# EAGLE design uacs-top (EAGLE 7.1.0)

## Sheet 1 of 3: DISPLAY
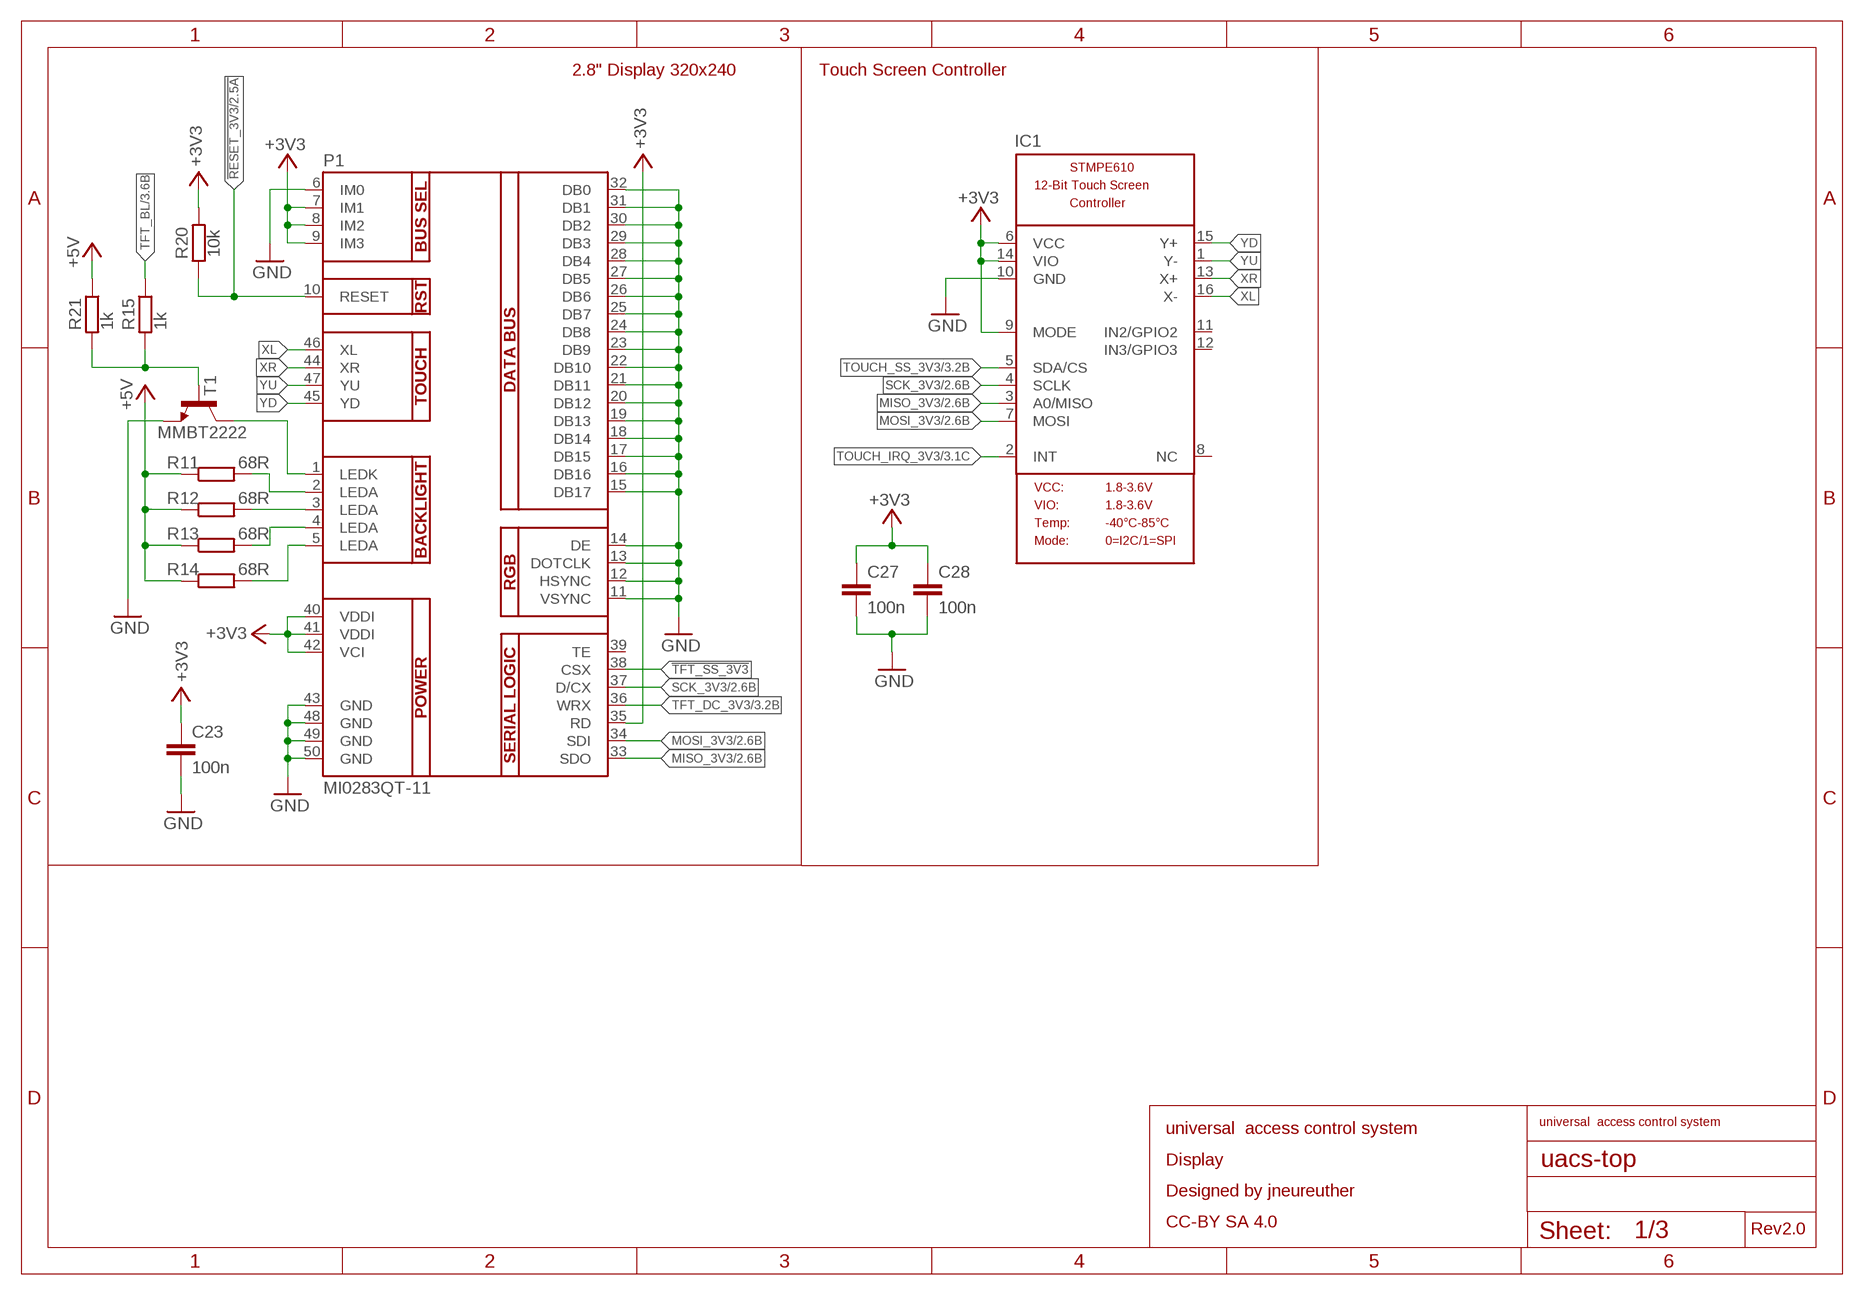
[diagram p0: schematic, sheet 1]

### Parts
C23  100n  C-EUC0603  [C0603]
C27  100n  C-EUC0603  [C0603]
C28  100n  C-EUC0603  [C0603]
IC1  STMPE610  [QFN16_3MM]
P1  MI0283QT-11  [MI0283QT-11]
R11  68R  R-EU_R0603  [R0603]
R12  68R  R-EU_R0603  [R0603]
R13  68R  R-EU_R0603  [R0603]
R14  68R  R-EU_R0603  [R0603]
R15  1k  R-EU_R0603  [R0603]
R20  10k  R-EU_R0603  [R0603]
R21  1k  R-EU_R0603  [R0603]
T1  MMBT2222  MMBT2222ALT1-NPN-SOT23-BEC  [SOT23-BEC]

### Nets
!RESET_3V3: P1.10(RESET) R20.1 ; also sheet 2,3
!TFT_SS_3V3: P1.38(CSX)
+3V3: C23.1 C27.1 C28.1 IC1.6(VCC) IC1.9(MODE) IC1.14(VIO) P1.7(IM1) P1.8(IM2) P1.9(IM3) P1.35(RD) P1.40(VDDI) P1.41(VDDI) P1.42(VCI) R20.2 ; also sheet 2,3
+5V: R11.1 R12.1 R13.1 R14.1 R21.1 ; also sheet 3
GND: C23.2 C27.2 C28.2 IC1.10(GND) P1.6(IM0) P1.11(VSYNC) P1.12(HSYNC) P1.13(DOTCLK) P1.14(DE) P1.15(DB17) P1.16(DB16) P1.17(DB15) P1.18(DB14) P1.19(DB13) P1.20(DB12) P1.21(DB11) P1.22(DB10) P1.23(DB9) P1.24(DB8) P1.25(DB7) P1.26(DB6) P1.27(DB5) P1.28(DB4) P1.29(DB3) P1.30(DB2) P1.31(DB1) P1.32(DB0) P1.43(GND) P1.48(GND) P1.49(GND) P1.50(GND) T1.E ; also sheet 2,3
MISO_3V3: IC1.3(A0/MISO) P1.33(SDO) ; also sheet 2,3
MOSI_3V3: IC1.7(MOSI) P1.34(SDI) ; also sheet 2,3
N$15: P1.5(LEDA) R14.2
N$16: P1.4(LEDA) R13.2
N$17: P1.3(LEDA) R12.2
N$18: P1.2(LEDA) R11.2
N$19: P1.1(LEDK) T1.C
N$21: R15.2 R21.2 T1.B
SCK_3V3: IC1.4(SCLK) P1.37(D/CX) ; also sheet 2,3
TFT_BL: R15.1 ; also sheet 3
TFT_DC_3V3: P1.36(WRX) ; also sheet 3
TOUCH_IRQ_3V3: IC1.2(INT) ; also sheet 3
TOUCH_SS_3V3: IC1.5(SDA/CS) ; also sheet 3
XL: IC1.16(X-) P1.46(XL)
XR: IC1.13(X+) P1.44(XR)
YD: IC1.15(Y+) P1.45(YD)
YU: IC1.1(Y-) P1.47(YU)
Unconnected: IC1.8(NC) IC1.11(IN2/GPIO2) IC1.12(IN3/GPIO3) P1.39(TE)

### Notes on the sheet
- 2.8" Display 320x240 | Touch Screen Controller
- universal  access control system
- universal  access control system
  Display
  Designed by jneureuther
  CC-BY SA 4.0
- Rev2.0

## Sheet 2 of 3: RFID
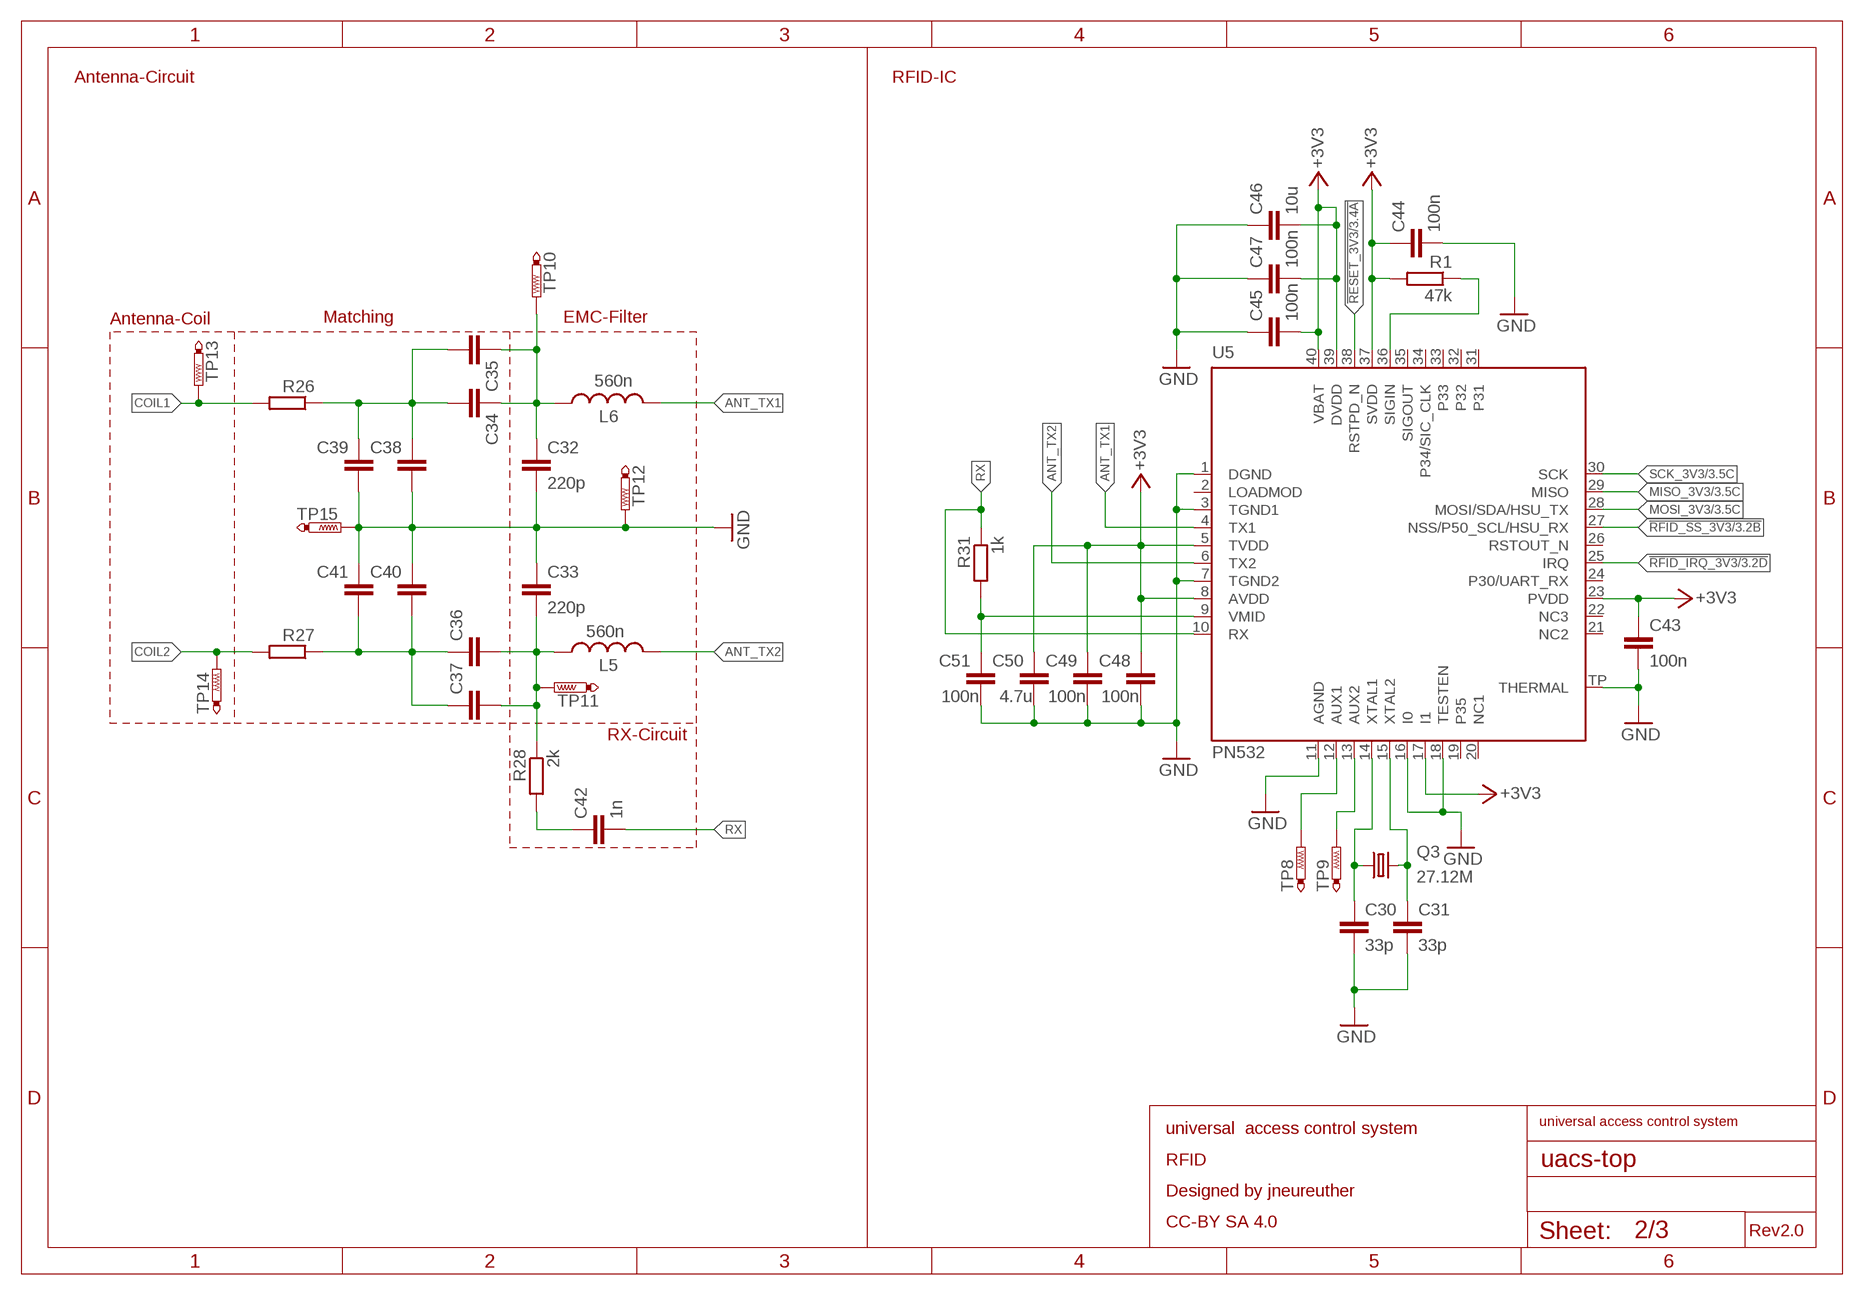
[diagram p1: schematic, sheet 2]

### Parts
C30  33p  C-EUC0603  [C0603]
C31  33p  C-EUC0603  [C0603]
C32  220p  C-EUC0603  [C0603]
C33  220p  C-EUC0603  [C0603]
C34  C-EUC0603  [C0603]
C35  C-EUC0603  [C0603]
C36  C-EUC0603  [C0603]
C37  C-EUC0603  [C0603]
C38  C-EUC0603  [C0603]
C39  C-EUC0603  [C0603]
C40  C-EUC0603  [C0603]
C41  C-EUC0603  [C0603]
C42  1n  C-EUC0603  [C0603]
C43  100n  C-EUC0603  [C0603]
C44  100n  C-EUC0603  [C0603]
C45  100n  C-EUC0603  [C0603]
C46  10u  C-EUC0603  [C0603]
C47  100n  C-EUC0603  [C0603]
C48  100n  C-EUC0603  [C0603]
C49  100n  C-EUC0603  [C0603]
C50  4.7u  C-EUC0603  [C0603]
C51  100n  C-EUC0603  [C0603]
L5  560n  INDUCTOR0805  [0805]
L6  560n  INDUCTOR0805  [0805]
Q3  27.12M  CRYSTALCTS406  [CTS406]
R1  47k  R-EU_R0603  [R0603]
R26  R-EU_R0603  [R0603]
R27  R-EU_R0603  [R0603]
R28  2k  R-EU_R0603  [R0603]
R31  1k  R-EU_R0603  [R0603]
TP8  PTR1TP20R  [TP20R]
TP9  PTR1TP20R  [TP20R]
TP10  PTR1TP20R  [TP20R]
TP11  PTR1TP20R  [TP20R]
TP12  PTR1TP20R  [TP20R]
TP13  PTR1TP20R  [TP20R]
TP14  PTR1TP20R  [TP20R]
TP15  PTR1TP20R  [TP20R]
U5  PN532  [HVQFN40-6X6]

### Nets
!RESET_3V3: U5.38(RSTPD_N) ; also sheet 1,3
!RFID_IRQ_3V3: U5.25(IRQ) ; also sheet 3
!RFID_SS_3V3: U5.27(NSS/P50_SCL/HSU_RX) ; also sheet 3
+3V3: C43.1 C44.1 C45.2 C46.2 C47.2 C48.1 C49.1 C50.1 R1.2 U5.5(TVDD) U5.8(AVDD) U5.17(I1) U5.23(PVDD) U5.37(SVDD) U5.39(DVDD) U5.40(VBAT) ; also sheet 1,3
ANT_TX1: L6.1 U5.4(TX1)
ANT_TX2: L5.1 U5.6(TX2)
COIL1: R26.2 TP13.TP
COIL2: R27.2 TP14.TP
GND: C30.2 C31.2 C32.2 C33.1 C38.2 C39.2 C40.1 C41.1 C43.2 C44.2 C45.1 C46.1 C47.1 C48.2 C49.2 C50.2 C51.2 TP12.TP TP15.TP U5.1(DGND) U5.3(TGND1) U5.7(TGND2) U5.11(AGND) U5.16(I0) U5.18(TESTEN) U5.TP(THERMAL) ; also sheet 1,3
MISO_3V3: U5.29(MISO) ; also sheet 1,3
MOSI_3V3: U5.28(MOSI/SDA/HSU_TX) ; also sheet 1,3
N$1: R1.1 U5.36(SIGIN)
N$20: C42.1 R28.2
N$22: TP8.TP U5.12(AUX1)
N$23: TP9.TP U5.13(AUX2)
N$24: C33.2 C36.2 C37.2 L5.2 R28.1 TP11.TP
N$25: C32.1 C34.1 C35.1 L6.2 TP10.TP
N$26: C51.1 R31.2 U5.9(VMID)
N$27: C34.2 C35.2 C38.1 C39.1 R26.1
N$29: C30.1 Q3.1 U5.14(XTAL1)
N$30: C31.1 Q3.3 U5.15(XTAL2)
N$43: C36.1 C37.1 C40.2 C41.2 R27.1
RX: C42.2 R31.1 U5.10(RX)
SCK_3V3: U5.30(SCK) ; also sheet 1,3
Unconnected: U5.2(LOADMOD) U5.19(P35) U5.20(NC1) U5.21(NC2) U5.22(NC3) U5.24(P30/UART_RX) U5.26(RSTOUT_N) U5.31 U5.32 U5.33 U5.34(P34/SIC_CLK) U5.35(SIGOUT)

### Notes on the sheet
- Antenna-Circuit | RFID-IC
- Antenna-Coil | Matching | EMC-Filter
- RX-Circuit
- universal access control system
- universal  access control system
  RFID
  Designed by jneureuther
  CC-BY SA 4.0
- Rev2.0

## Sheet 3 of 3
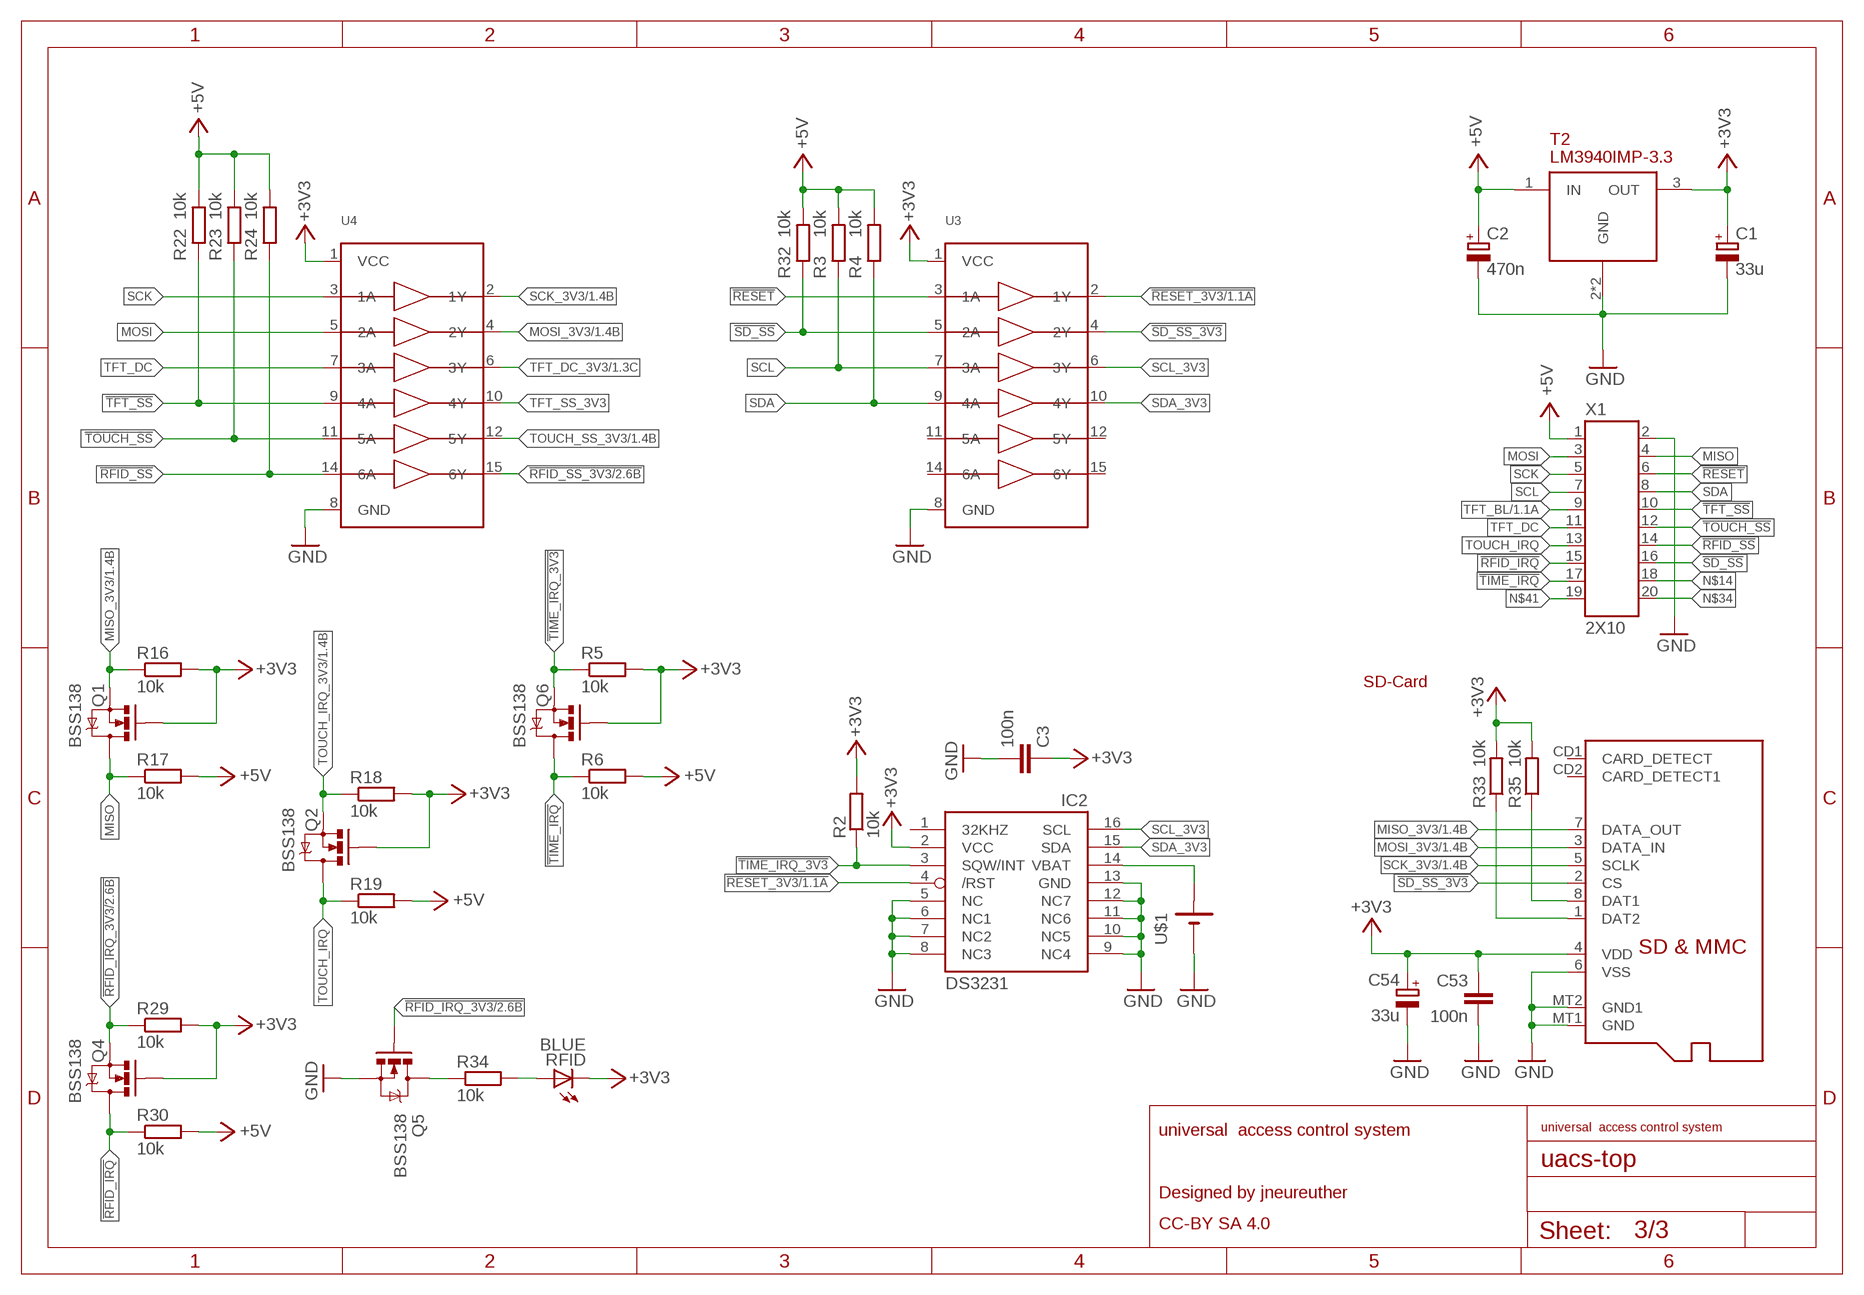
[diagram p2: schematic, sheet 3]

### Parts
C1  33u  CPOL-EUD  [PANASONIC_D]
C2  470n  CPOL-EUB  [PANASONIC_B]
C3  100n  C-EUC0603  [C0603]
C53  100n  C-EUC0603  [C0603]
C54  33u  CPOL-EUC/6032-28R  [C/6032-28R]
IC2  DS3231/SO  [SO16W]
Q1  BSS138  MOSFET-NCHANNELBSS123LT1G  [SOT23]
Q2  BSS138  MOSFET-NCHANNELBSS123LT1G  [SOT23]
Q4  BSS138  MOSFET-NCHANNELBSS123LT1G  [SOT23]
Q5  BSS138  MOSFET-NCHANNELBSS123LT1G  [SOT23]
Q6  BSS138  MOSFET-NCHANNELBSS123LT1G  [SOT23]
R2  10k  R-EU_R0603  [R0603]
R3  10k  R-EU_R0603  [R0603]
R4  10k  R-EU_R0603  [R0603]
R5  10k  R-EU_R0603  [R0603]
R6  10k  R-EU_R0603  [R0603]
R16  10k  R-EU_R0603  [R0603]
R17  10k  R-EU_R0603  [R0603]
R18  10k  R-EU_R0603  [R0603]
R19  10k  R-EU_R0603  [R0603]
R22  10k  R-EU_R0603  [R0603]
R23  10k  R-EU_R0603  [R0603]
R24  10k  R-EU_R0603  [R0603]
R29  10k  R-EU_R0603  [R0603]
R30  10k  R-EU_R0603  [R0603]
R32  10k  R-EU_R0603  [R0603]
R33  10k  R-EU_R0603  [R0603]
R34  10k  R-EU_R0603  [R0603]
R35  10k  R-EU_R0603  [R0603]
RFID  BLUE  LEDCHIP-LED0603  [CHIP-LED0603]
T2  LM3940IMP-3.3  [SOT223]
U3  74HC4050D  [SOIC16]
U4  74HC4050D  [SOIC16]
U$1  CR1220SMT  [CR1220-SMD]
X1  2X10  [2X10]
X3  MICROSD  [MICROSD]

### Nets
!RESET: U3.3(1A) X1.6
!RESET_3V3: IC2.4(/RST) U3.2(1Y) ; also sheet 1,2
!RFID_IRQ: Q4.3(D) R30.1 X1.15
!RFID_IRQ_3V3: Q4.2(S) Q5.1(G) R29.1 ; also sheet 2
!RFID_SS: R24.1 U4.14(6A) X1.14
!RFID_SS_3V3: U4.15(6Y) ; also sheet 2
!SD_SS: R32.1 U3.5(2A) X1.16
!SD_SS_3V3: U3.4(2Y) X3.2(CS)
!TFT_SS: R22.1 U4.9(4A) X1.10
!TIME_IRQ: Q6.3(D) R6.1 X1.17
!TIME_IRQ_3V3: IC2.3(SQW/INT) Q6.2(S) R2.1 R5.1
!TOUCH_SS: R23.1 U4.11(5A) X1.12
+3V3: C1.+ C3.1 C53.1 C54.+ IC2.2(VCC) Q1.1(G) Q2.1(G) Q4.1(G) Q6.1(G) R2.2 R5.2 R16.2 R18.2 R29.2 R33.2 R35.2 RFID.C T2.3(OUT) U3.1(VCC) U4.1(VCC) X3.4(VDD) ; also sheet 1,2
+5V: C2.+ R3.2 R4.2 R6.2 R17.2 R19.2 R22.2 R23.2 R24.2 R30.2 R32.2 T2.1(IN) X1.1 ; also sheet 1
GND: C1.- C2.- C3.2 C53.2 C54.- IC2.5(NC) IC2.6(NC1) IC2.7(NC2) IC2.8(NC3) IC2.9(NC4) IC2.10(NC5) IC2.11(NC6) IC2.12(NC7) IC2.13(GND) Q5.2(S) T2.2(GND) T2.4(GND) U3.8(GND) U4.8(GND) U$1.-(VSS) X1.2 X3.6(VSS) X3.MT1(GND) X3.MT2(GND1) ; also sheet 1,2
MISO: Q1.3(D) R17.1 X1.4
MISO_3V3: Q1.2(S) R16.1 X3.7(DATA_OUT) ; also sheet 1,2
MOSI: U4.5(2A) X1.3
MOSI_3V3: U4.4(2Y) X3.3(DATA_IN) ; also sheet 1,2
N$2: IC2.14(VBAT) U$1.+$1(VCC) U$1.+$2(VCC)
N$14: X1.18
N$28: R35.1 X3.8(DAT1)
N$31: R34.2 RFID.A
N$32: R33.1 X3.1(DAT2)
N$33: Q5.3(D) R34.1
N$34: X1.20
N$41: X1.19
SCK: U4.3(1A) X1.5
SCK_3V3: U4.2(1Y) X3.5(SCLK) ; also sheet 1,2
SCL: R3.1 U3.7(3A) X1.7
SCL_3V3: IC2.16(SCL) U3.6(3Y)
SDA: R4.1 U3.9(4A) X1.8
SDA_3V3: IC2.15(SDA) U3.10(4Y)
TFT_BL: X1.9 ; also sheet 1
TFT_DC: U4.7(3A) X1.11
TFT_DC_3V3: U4.6(3Y) ; also sheet 1
TFT_SS_3V3: U4.10(4Y)
TOUCH_IRQ: Q2.3(D) R19.1 X1.13
TOUCH_IRQ_3V3: Q2.2(S) R18.1 ; also sheet 1
TOUCH_SS_3V3: U4.12(5Y) ; also sheet 1
Unconnected: IC2.1(32KHZ) U3.11(5A) U3.12(5Y) U3.14(6A) U3.15(6Y) X3.CD1(CARD_DETECT) X3.CD2(CARD_DETECT1)

### Notes on the sheet
- SD-Card
- universal  access control system
- universal  access control system
  
  Designed by jneureuther
  CC-BY SA 4.0

## Library data of the parts
C1 C2 C54 = rcl:CPOL-EU: POLARIZED CAPACITOR, European symbol
C3 C23 C27 C28 C30-C51 C53 = rcl:C-EU: CAPACITOR, European symbol
IC1 = microbuilder:STMPE610: STMPE610 - 12-Bit Touch Screen Controller
IC2 = adafruit:DS3231
L5 L6 = SparkFun-Passives:INDUCTOR: Inductors Basic Inductor/Choke - 0603 and 1206. Footprints are not proven and vary greatly between part numbers. SRN6045- 33uH, 20% 1.4A SDR0403-560KL - 56uH, 10%, 500mA RMS/740mA peak
P1 = MI0283QT-11:MI0283QT-11: LCD MODULE SPECIFICATION Model : MI0283QT-11
Q1 Q2 Q4-Q6 = SparkFun-DiscreteSemi:MOSFET-NCHANNEL: Common NMOSFET Parts MFG P/N Store ID Prod ID FDD8780 TRANS-09984 SI7820DN TRANS-11055 FDS6630A IC-08089 2N7002PW TRANS-11151 FQP30N06L COM-10213 TRANS-10060 BSS123LT1G TRANS-08345 BSS138 TRANS-00830 BS170 2N7000; PROD_ID: TRANS-08345
Q3 = crystal:CRYSTAL: CRYSTAL; OC_FARNELL: unknown; OC_NEWARK: unknown
R1-R6 R11-R24 R26-R35 = rcl:R-EU_: RESISTOR, European symbol
RFID = adafruit:LED: LED OSRAM: - CHIPLED LG R971, LG N971, LY N971, LG Q971, LY Q971, LO R971, LY R971 LH N974, LH R974 LS Q976, LO Q976, LY Q976 LO Q996 - Hyper CHIPLED LW Q18S LB Q993, LB Q99A, LB R99A - SideLED LS A670, LO A670, LY A670, LG A670, LP A670 LB A673, LV A673, LT A673, LW A673 LH A674 LY A675 LS A676, LA A676, LO A676, LY A676, LW A676 LS A679, LY A679, LG A679 - Hyper Micro SIDELED® LS Y876, LA Y876, LO Y876, LY Y876 LT Y87S - SmartLED LW L88C, LW L88S LB L89C, LB L89S, LG L890 LS L89K, LO L89K, LY L89K LS L896, LA L896, LO L896, LY L896 - TOPLED LS T670, LO T670, LY T670, LG T670, LP T670 LSG T670, LSP T670, LSY T670, LOP T670, LYG T670 LG T671, LOG T671, LSG T671 LB T673, LV T673, LT T673, LW T673 LH T674 LS T676, LA T676, LO T676, LY T676, LB T676, LH T676, LSB T676, LW T676 LB T67C, LV T67C, LT T67C, LS T67K, LO T67K, LY T67K, LW E67C LS E67B, LA E67B, LO E67B, LY E67B, LB E67C, LV E67C, LT E67C LW T67C LS T679, LY T679, LG T679 LS T770, LO T770, LY T770, LG T770, LP T770 LB T773, LV T773, LT T773, LW T773 LH T774 LS E675, LA E675, LY E675, LS T675 LS T776, LA T776, LO T776, LY T776, LB T776 LHGB T686 LT T68C, LB T68C - Hyper Mini TOPLED® LB M676 - Mini TOPLED Santana® LG M470 LS M47K, LO M47K, LY M47K Source: http://www.osram.convergy.de/
T1 = transistor:*-NPN-: NPN Transistror BF959 corrected 2008.03.06
T2 = LM3940:LM3940IMP-3.3: 1A Low Dropout Regulator for 5V to 3.3V Conversion
TP8-TP15 = testpad:PTR1: TEST PIN
U3 U4 = microbuilder:74HC4050D: 6-channel level shifter 74HC4050D - 2V-6V Supply SOIC16 Digikey: 74HC4050D,653-ND Mouser: 771-74HC4050D-T TSSOP16 Digikey: 296-9215-1-ND Mouser:
U5 = microbuilder:PN532: PN532 - Near Field Communication (NFC) controller Highly integrated transceiver module for contactless communication at 13.56 MHz (14443A/MIFARE, FeliCa, I4443B)
U$1 = adafruit:CR1220: CR1216/CR1220/CR1225 12mm 3V lithium coin cell Great for battery packup. Both SMT and THM holders. Note the THM package has the ground pads on both sides of the PCB so that the masks are the same - this reduces the cost
X1 = pinheader-smd:2X10
X3 = adafruit:MICROSD: Micro-SD / Transflash card holder with SPI pinout For the 3M # 2908-05WB-MG and/or 4UCON #19656 push-push type

## Board
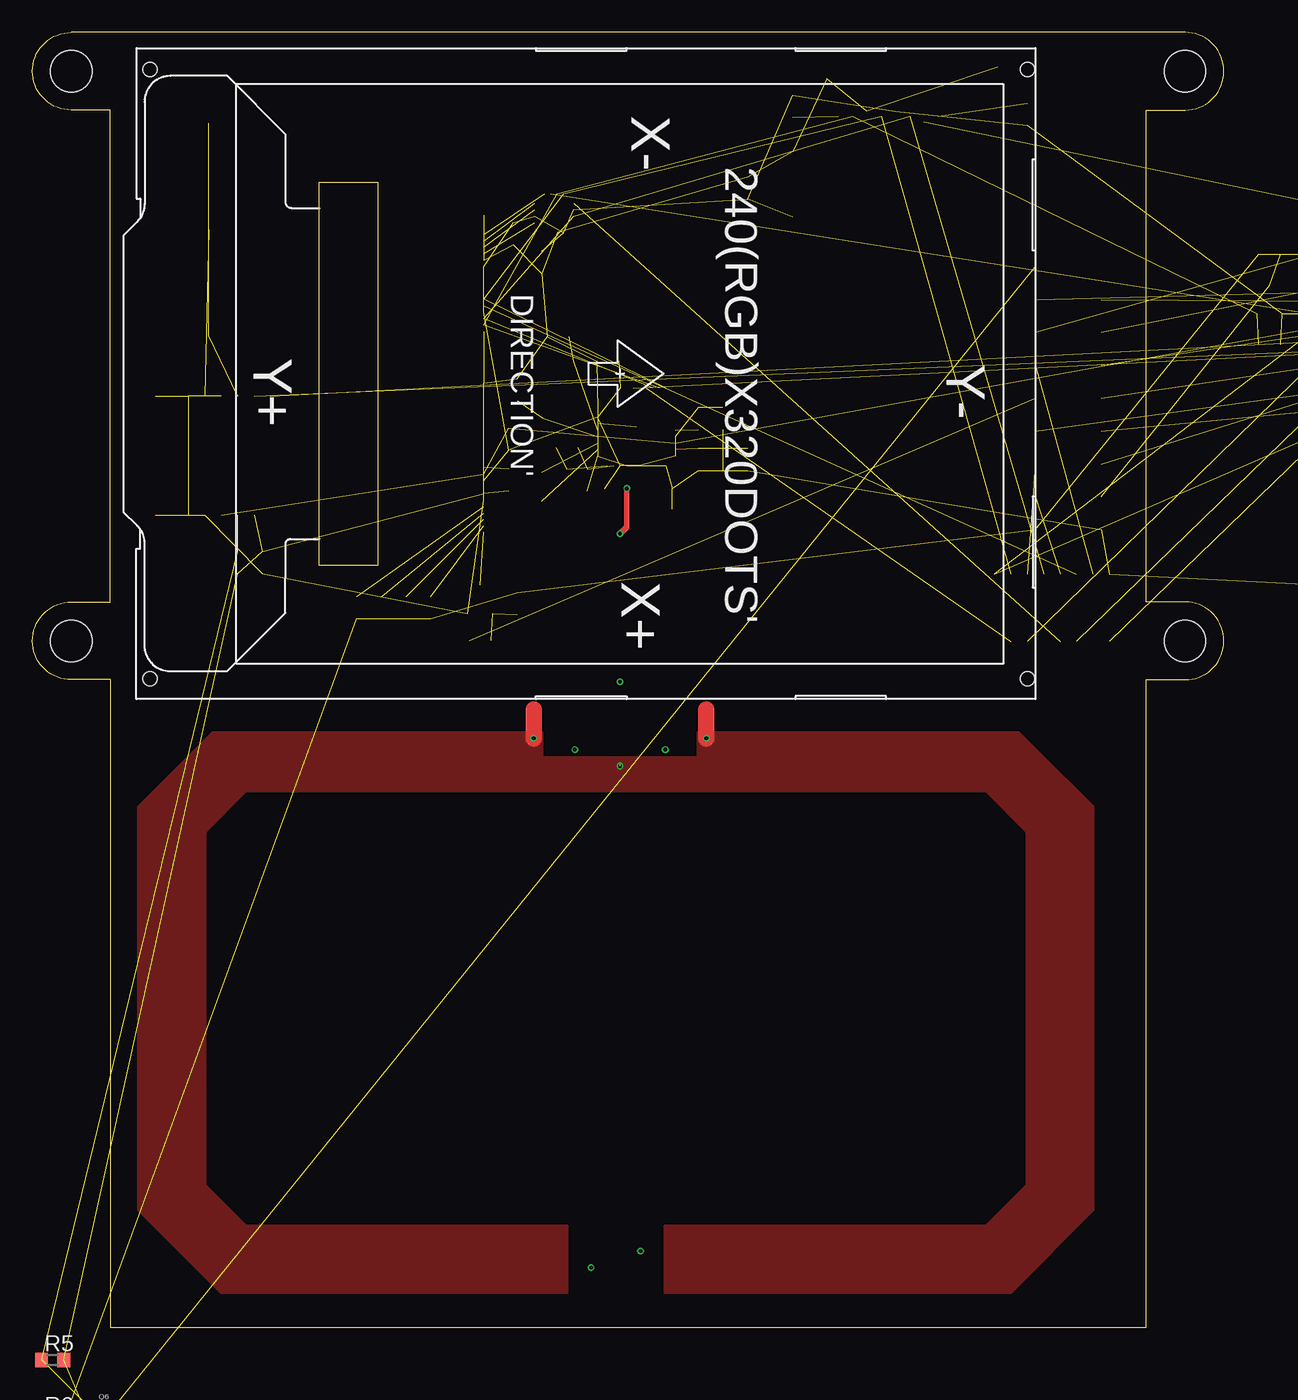
[diagram p3: board, top side]
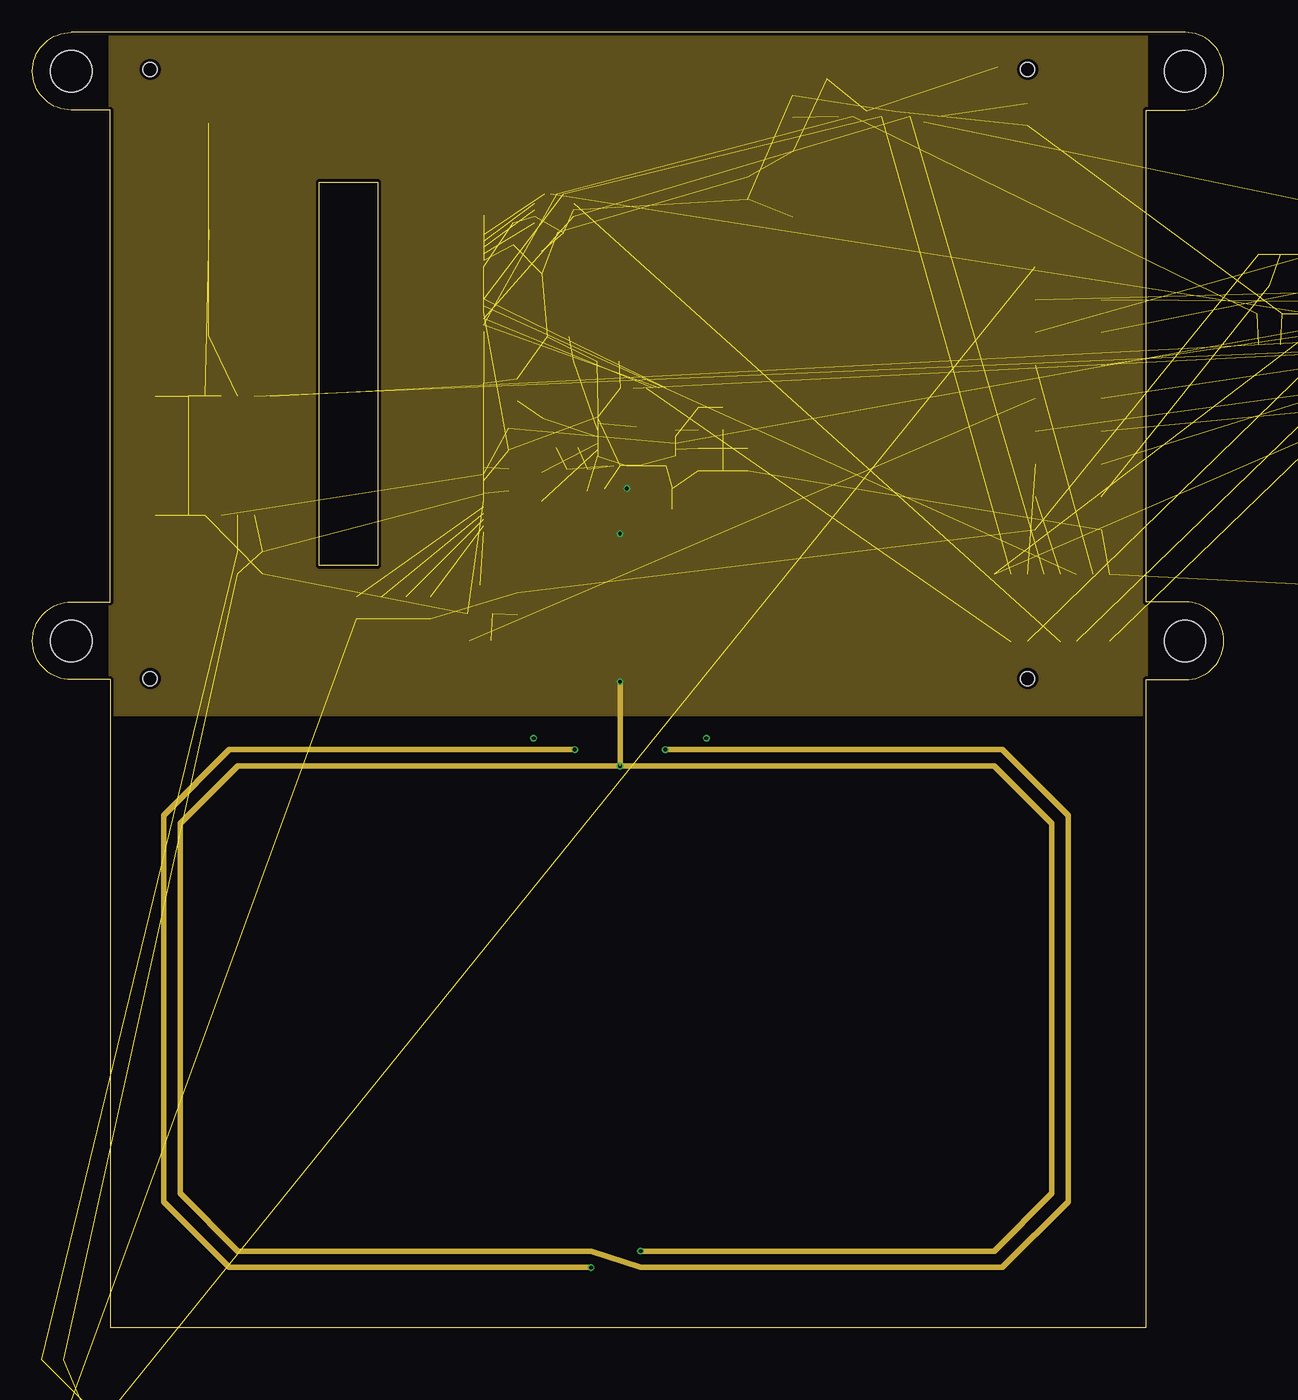
[diagram p4: board, inner layer Route2]
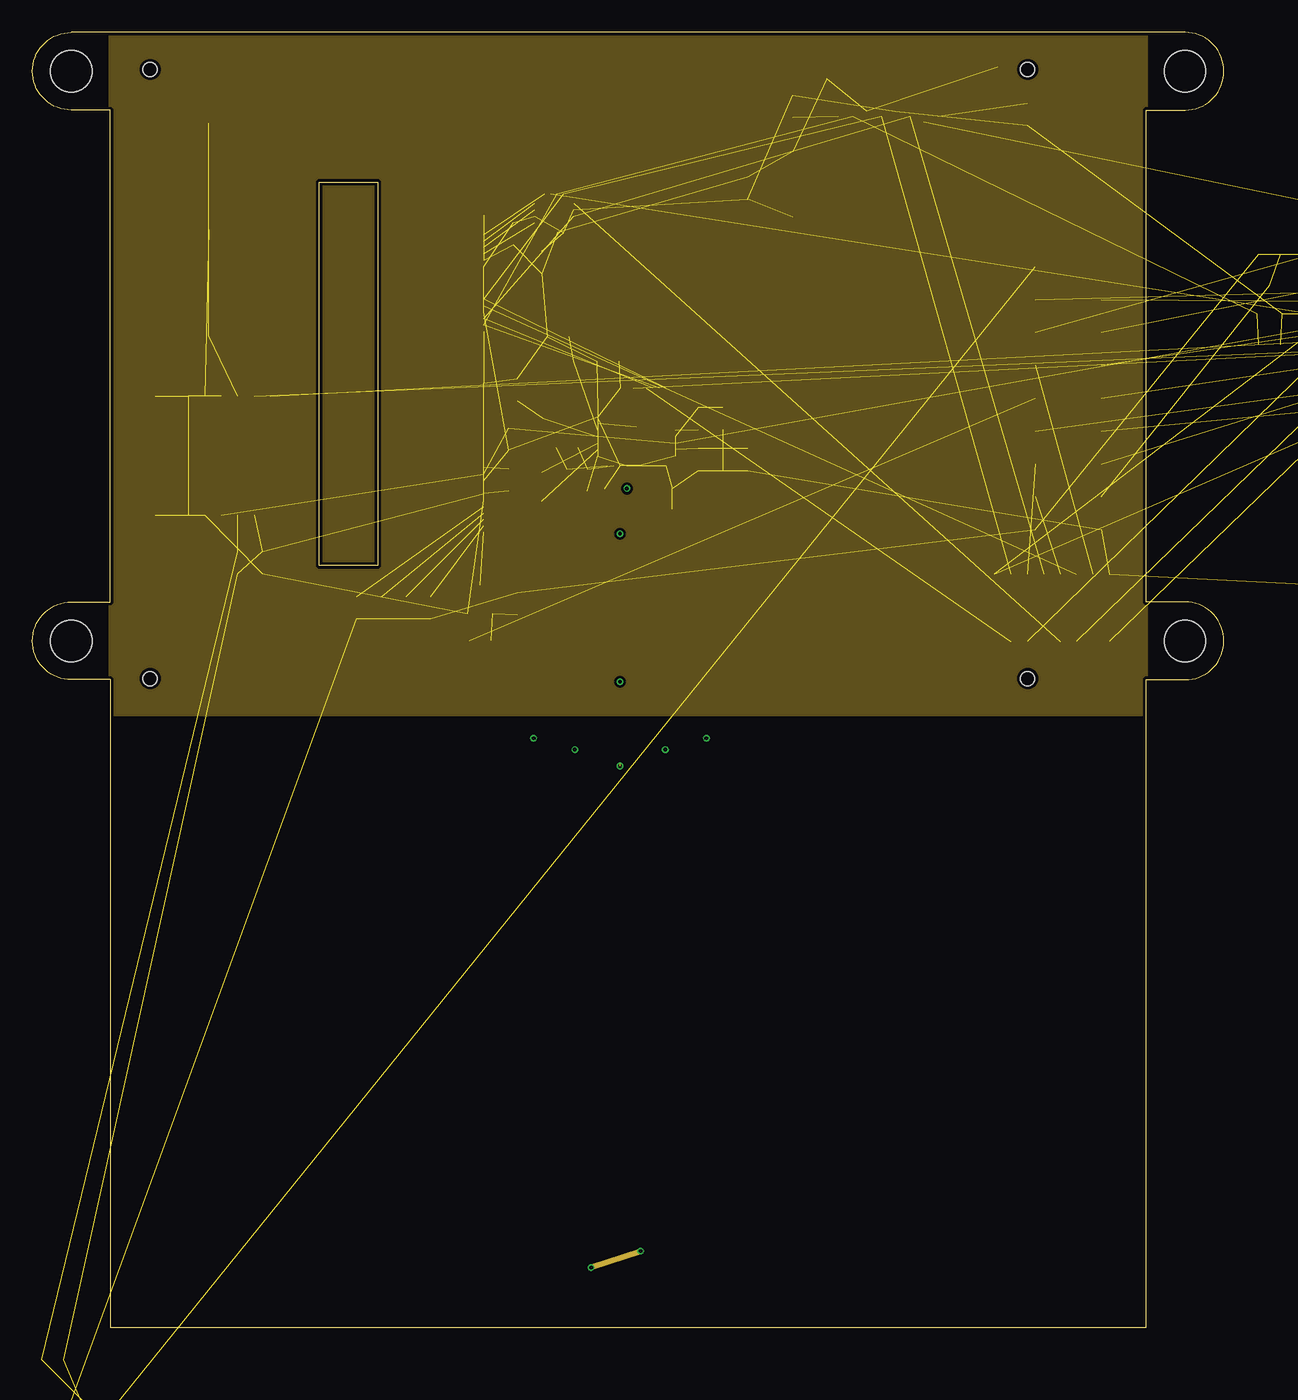
[diagram p5: board, inner layer Route15]
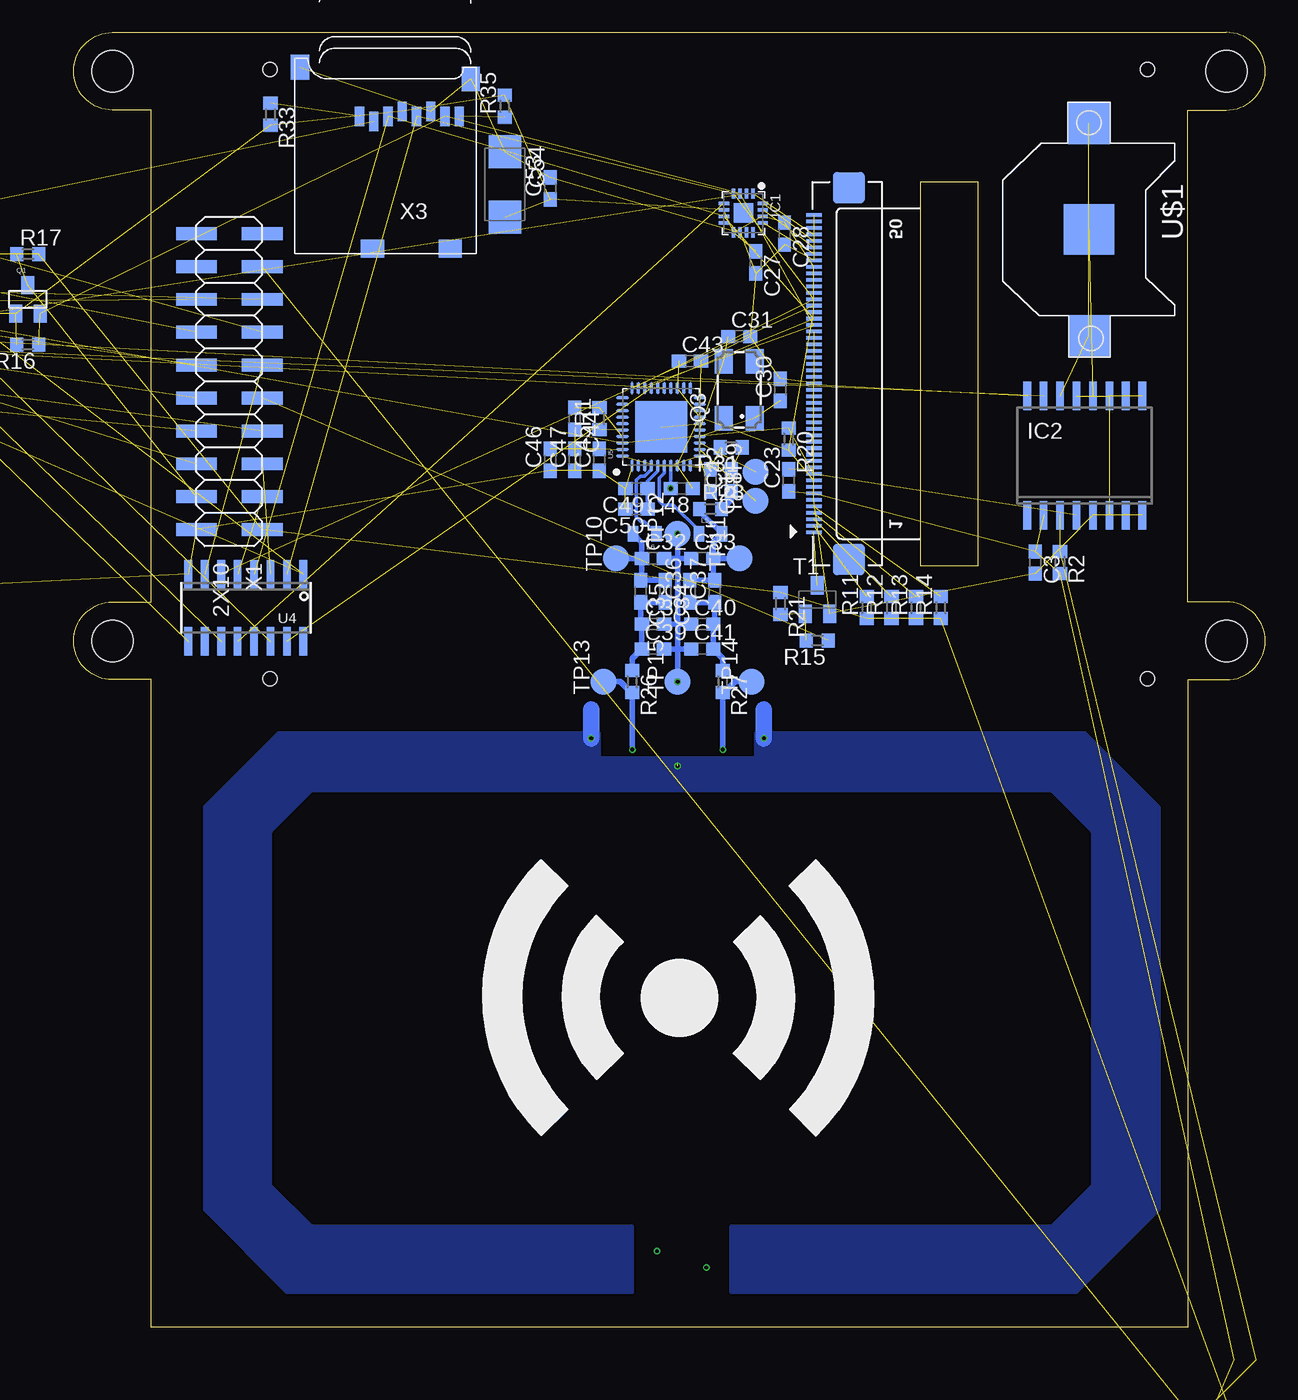
[diagram p6: board, bottom side, seen from below]

Size 92 x 100 mm. Coordinates in mm from the lower left corner, seen from the top.
Outline: 6,0 86,0 86,50 89,50 arc90 92,53 arc90 89,56 86,56 86,94 89,94 arc90 92,97 arc90 89,100 3,100 arc90 0,97 arc90 3,94 6,94 6,56 3,56 arc90 0,53 arc90 3,50 6,50 6,0
Copper layers (1*2*15*16): Top 0.035mm / dielectric 0.2mm / Route2 0.0175mm / dielectric 0.3mm / Route15 0.0175mm / dielectric 0.2mm / Bottom 0.035mm
Design rules "SeeedStudio_4layer_layer2+15": minimum track width 8mil, minimum drill 12mil, track to track 8mil, track to pad 8mil, pad to pad 8mil, via to via 8mil, smd to smd 0mil, copper to edge 10mil, drill to drill 8mil, minimum pad ring 6mil, minimum via ring 4mil, stop-mask expansion 4mil, vias tented up to drill 100mil, thermal gap 10mil
Holes 3.2 mm at 3,97 89,97 3,53 89,53

### Footprints (pad centres in the part's own frame; a part is rotated, then mirrored left to right if it is on the bottom)
PANASONIC_D = smd 3 x 1.4: + 2.4,0; - -2.4,0
PANASONIC_B = smd 2.2 x 1.4: + 1.6,0; - -1.6,0
C0603 = smd 1.1 x 1: 1 -0.85,0; 2 0.85,0
C/6032-28R = smd 2.55 x 2.5: + 2.525,0; - -2.525,0
QFN16_3MM = smd 0.8 x 0.28: 1 -1.5,0.75; 2 -1.5,0.25; 3 -1.5,-0.25; 4 -1.5,-0.75; 9 1.5,-0.75; 10 1.5,-0.25; 11 1.5,0.25; 12 1.5,0.75 | smd 0.28 x 0.8: 5 -0.75,-1.5; 6 -0.25,-1.5; 7 0.25,-1.5; 8 0.75,-1.5; 13 0.75,1.5; 14 0.25,1.5; 15 -0.25,1.5; 16 -0.75,1.5 | smd 1.5 x 1.5: THERMAL 0,0
SO16W = smd 0.6 x 2.2: 1 -4.445,-4.6; 2 -3.175,-4.6; 3 -1.905,-4.6; 4 -0.635,-4.6; 5 0.635,-4.6; 6 1.905,-4.6; 7 3.175,-4.6; 8 4.445,-4.6; 9 4.445,4.6; 10 3.175,4.6; 11 1.905,4.6; 12 0.635,4.6; 13 -0.635,4.6; 14 -1.905,4.6; 15 -3.175,4.6; 16 -4.445,4.6
0805 = smd 0.8 x 1.2: 1 -0.9,0; 2 0.9,0
MI0283QT-11 = smd 1.2 x 0.275 bottom: 1 -10.525,-12.268; 2 -10.525,-11.768; 3 -10.525,-11.268; 4 -10.525,-10.768; 5 -10.525,-10.268; 6 -10.525,-9.768; 7 -10.525,-9.268; 8 -10.525,-8.768; 9 -10.525,-8.268; 10 -10.525,-7.768; 11 -10.525,-7.268; 12 -10.525,-6.768; 13 -10.525,-6.268; 14 -10.525,-5.768; 15 -10.525,-5.268; 16 -10.525,-4.768; 17 -10.525,-4.268; 18 -10.525,-3.768; 19 -10.525,-3.268; 20 -10.525,-2.768; 21 -10.525,-2.268; 22 -10.525,-1.768; 23 -10.525,-1.268; 24 -10.525,-0.768; 25 -10.525,-0.268; 26 -10.525,0.232; 27 -10.525,0.732; 28 -10.525,1.232; 29 -10.525,1.732; 30 -10.525,2.232; 31 -10.525,2.732; 32 -10.525,3.232; 33 -10.525,3.732; 34 -10.525,4.232; 35 -10.525,4.732; 36 -10.525,5.232; 37 -10.525,5.732; 38 -10.525,6.232; 39 -10.525,6.732; 40 -10.525,7.232; 41 -10.525,7.732; 42 -10.525,8.232; 43 -10.525,8.732; 44 -10.525,9.232; 45 -10.525,9.732; 46 -10.525,10.232; 47 -10.525,10.732; 48 -10.525,11.232; 49 -10.525,11.732; 50 -10.525,12.232 | smd 2.4 x 2.4 bottom: GND2 -13.225,14.332; PAD3 -13.225,-14.368 | hole 1.1: -36.28,-23.57; -36.28,23.47; 31.47,-23.57; 31.47,23.47
SOT23 = smd 1 x 1.4: 1 -0.95,-1.1; 2 0.95,-1.1; 3 0,1.1
CTS406 = smd 1.9 x 1.4: 1 -2.2,-1.2; 2 2.2,-1.2; 3 2.2,1.2; 4 -2.2,1.2
R0603 = smd 1 x 1.1: 1 -0.85,0; 2 0.85,0
CHIP-LED0603 = smd 0.8 x 0.8: A 0,-0.75; C 0,0.75
SOT23-BEC = smd 1 x 1.4: B -0.95,-1.1; C 0,1.1; E 0.95,-1.1
SOT223 = smd 1.219 x 2.235: 1 -2.311,-3.099; 2 0,-3.099; 3 2.311,-3.099 | smd 3.6 x 2.2: 4 0,3.099
TP20R = smd 2 x 2: TP 0,0
SOIC16 = smd 0.6 x 2.2: 1 -4.445,-2.6; 2 -3.175,-2.6; 3 -1.905,-2.6; 4 -0.635,-2.6; 5 0.635,-2.6; 6 1.905,-2.6; 7 3.175,-2.6; 8 4.445,-2.6; 9 4.445,2.6; 10 3.175,2.6; 11 1.905,2.6; 12 0.635,2.6; 13 -0.635,2.6; 14 -1.905,2.6; 15 -3.175,2.6; 16 -4.445,2.6
HVQFN40-6X6 = smd 1 x 0.25: 1 -2.99,2.25; 2 -2.99,1.75; 3 -2.99,1.25; 4 -2.99,0.75; 5 -2.99,0.25; 6 -2.99,-0.25; 7 -2.99,-0.75; 8 -2.99,-1.25; 9 -2.99,-1.75; 10 -2.99,-2.25; 21 2.99,-2.25; 22 2.99,-1.75; 23 2.99,-1.25; 24 2.99,-0.75; 25 2.99,-0.25; 26 2.99,0.25; 27 2.99,0.75; 28 2.99,1.25; 29 2.99,1.75; 30 2.99,2.25 | smd 0.25 x 1: 11 -2.25,-2.99; 12 -1.75,-2.99; 13 -1.25,-2.99; 14 -0.75,-2.99; 15 -0.25,-2.99; 16 0.25,-2.99; 17 0.75,-2.99; 18 1.25,-2.99; 19 1.75,-2.99; 20 2.25,-2.99; 31 2.25,2.99; 32 1.75,2.99; 33 1.25,2.99; 34 0.75,2.99; 35 0.25,2.99; 36 -0.25,2.99; 37 -0.75,2.99; 38 -1.25,2.99; 39 -1.75,2.99; 40 -2.25,2.99 | smd 4 x 4: TP 0,0
CR1220-SMD = smd 3.2 x 3.2: +$1 -8.2,0; +$2 8.2,0 | smd 3.9 x 3.9: - 0,0
2X10 = smd 1 x 3.15: 1 11.43,2.54; 2 11.43,-2.54; 3 8.89,2.54; 4 8.89,-2.54; 5 6.35,2.54; 6 6.35,-2.54; 7 3.81,2.54; 8 3.81,-2.54; 9 1.27,2.54; 10 1.27,-2.54; 11 -1.27,2.54; 12 -1.27,-2.54; 13 -3.81,2.54; 14 -3.81,-2.54; 15 -6.35,2.54; 16 -6.35,-2.54; 17 -8.89,2.54; 18 -8.89,-2.54; 19 -11.43,2.54; 20 -11.43,-2.54
MICROSD = smd 0.7 x 1.5: 1 9,-10.64; 2 7.9,-10.24; 3 6.8,-10.64; 4 5.7,-11.04; 5 4.6,-10.64; 6 3.5,-11.04; 7 2.4,-10.64; 8 1.3,-10.64 | smd 1.8 x 1.4: CD1 2,-0.44; CD2 8,-0.44 | smd 1.4 x 1.9: MT1 0.4,-13.54; MT2 13.6,-14.44

### Placement (x,y rotation side)
C1  140.94,32.07 270 bottom  (outside the outline)
C2  154.91,31.75 270 bottom  (outside the outline)
C3  17.75,59.05 270 bottom
C23  36.8,65.41 90 bottom
C27  39.34,82.23 270 bottom
C28  37.11,84.45 270 bottom
C30  37.43,72.39 90 bottom
C31  40.61,76.52 0 bottom
C32  47.27,59.37 0 bottom
C33  43.47,59.37 0 bottom
C34  46.32,56.83 270 bottom
C35  48.23,56.83 270 bottom
C36  44.42,56.83 90 bottom
C37  42.51,56.83 90 bottom
C38  47.27,54.29 0 bottom
C39  47.27,52.39 0 bottom
C40  43.47,54.29 0 bottom
C41  43.47,52.39 0 bottom
C42  41.24,65.41 90 bottom
C43  44.42,74.61 0 bottom
C44  53.31,70.17 270 bottom
C45  51.4,66.99 90 bottom
C46  55.21,66.99 90 bottom
C47  53.31,66.99 90 bottom
C48  45.05,64.77 180 bottom
C49  48.55,64.77 180 bottom
C50  48.55,63.18 180 bottom
C51  42.83,65.41 270 bottom
C53  55.21,87.95 90 bottom
C54  58.7,88.27 270 bottom
IC1  40.29,86.04 270 bottom
IC2  13.94,67.31 0 bottom
L5  42.83,61.28 0 bottom
L6  47.91,61.28 180 bottom
P1  45.37,73.66 0 top
Q1  95.53,79.38 0 bottom
Q2  99.66,79.38 0 bottom  (outside the outline)
Q3  40.61,72.39 90 bottom
Q4  119.67,79.38 0 bottom  (outside the outline)
Q5  123.79,54.93 180 bottom  (outside the outline)
Q6  6,-7.62 0 top  (outside the outline)
R1  51.4,70.17 90 bottom
R2  15.84,59.05 270 bottom
R3  133.95,76.52 180 bottom  (outside the outline)
R4  125.06,72.39 270 bottom  (outside the outline)
R5  1.55,-2.54 0 top
R6  1.55,-7.3 0 top  (outside the outline)
R11  30.77,55.56 90 bottom
R12  28.86,55.56 90 bottom
R13  26.95,55.56 90 bottom
R14  25.05,55.56 90 bottom
R15  34.58,53.02 180 bottom
R16  95.53,75.88 180 bottom
R17  95.53,82.87 0 bottom
R18  99.66,75.56 180 bottom  (outside the outline)
R19  99.66,82.87 180 bottom  (outside the outline)
R20  36.8,68.58 270 bottom
R21  37.43,55.88 270 bottom
R22  105.38,75.25 0 bottom  (outside the outline)
R23  105.38,77.79 0 bottom  (outside the outline)
R24  105.38,81.6 0 bottom  (outside the outline)
R26  48.86,49.85 270 bottom
R27  41.88,49.85 270 bottom
R28  42.83,63.18 0 bottom
R29  119.67,76.2 180 bottom  (outside the outline)
R30  119.67,83.19 90 bottom  (outside the outline)
R31  41.24,67.94 180 bottom
R32  133.95,79.06 180 bottom  (outside the outline)
R33  76.8,93.66 270 bottom
R34  123.79,51.12 270 bottom  (outside the outline)
R35  58.7,94.3 90 bottom
RFID  123.79,47.94 180 bottom  (outside the outline)
T1  34.58,56.2 0 bottom
T2  148.24,32.07 0 bottom  (outside the outline)
TP8  39.34,63.82 90 bottom
TP9  39.34,66.04 90 bottom
TP10  50.13,59.37 90 bottom
TP11  40.61,59.37 90 bottom
TP12  45.37,61.28 90 bottom
TP13  51.09,49.85 90 bottom
TP14  39.66,49.85 90 bottom
TP15  45.37,49.85 90 bottom
U3  127.92,79.69 270 bottom  (outside the outline)
U4  78.71,55.56 180 bottom
U5  46.64,69.53 90 bottom
U$1  13.62,84.77 270 bottom
X1  79.98,73.03 270 bottom
X3  60.93,82.87 180 bottom

### Tracks (layer width: path | path; a pad name or v marks a point on that pad's centre or on a via)
!RESET  (1 unrouted)
!RESET_3V3  (4 unrouted)
!RFID_IRQ  (2 unrouted)
!RFID_IRQ_3V3  (3 unrouted)
!RFID_SS  (2 unrouted)
!RFID_SS_3V3  (1 unrouted)
!SD_SS  (2 unrouted)
!SD_SS_3V3  (1 unrouted)
!TFT_SS  (2 unrouted)
!TIME_IRQ  (2 unrouted)
!TIME_IRQ_3V3  (3 unrouted)
!TOUCH_SS  (2 unrouted)
+3V3  (48 unrouted)
  Bottom 0.254: U5.5 46.89,66.11 47.7,65.3 C49.1 C50.1
  pour Route15: 6,47.31 86.01,47.31 86.01,100.01 6,100.01
+5V  (17 unrouted)
ANT_TX1
  Bottom 0.254: L6.1 47.96,62.23 48.23,62.23 48.55,62.55 48.55,65.41 48.23,65.72 47.91,65.72 47.39,66.24 U5.4
ANT_TX2
  Bottom 0.254: L5.1 43.73,61.54 45.69,63.5 46.48,63.5 46.8,63.82 46.8,65.56 46.39,65.97 U5.6
COIL1  (via drill 0.3)
  Route2 0.406: v48.86,44.61 74.9,44.61 79.98,39.53 79.98,9.69 74.9,4.61 46.96,4.61 43.15,5.88 15.84,5.88 11.4,10.32 11.4,38.9 15.84,43.34 45.21,43.34
  Bottom 0.406: v48.86,44.61 R26.2 48.97,49 49.81,49.85 TP13.TP
COIL2  (via drill 0.3)
  Route2 0.406: v41.88,44.61 15.21,44.61 10.13,39.53 10.13,9.69 15.21,4.61 v43.15,4.61 | v46.96,5.88 74.26,5.88 78.71,10.32 78.71,38.9 74.26,43.34 45.53,43.34
  Route15 0.406: v43.15,4.61 v46.96,5.88
  Bottom 0.406: v41.88,44.61 R27.2 41.77,49 40.92,49.85 TP14.TP
GND  (via drill 0.3)  (73 unrouted)
  Top 0.406: TP12.TP 45.9,61.81 C48.2
  Top 1.27: 52.04,47.7 v52.04,45.48 | 38.7,47.7 v38.7,45.48
  Route2 0.406: 45.37,43.5 TP15.TP
  Bottom 0.254: C48.2 45.89,64.78 U5.7
  Bottom 0.406: TP15.TP 45.37,52.39 | 45.37,52.39 45.37,54.29 | 45.37,54.29 45.37,59.37 | 45.37,59.37 TP12.TP | C39.2 45.37,52.39 | C41.1 45.37,52.39 | C38.2 45.37,54.29 | C40.1 45.37,54.29 | C33.1 45.37,59.37 | C32.2 45.37,59.37
  Bottom 1.27: 38.7,47.7 v38.7,45.48 | 52.04,47.7 v52.04,45.48
  other vias: 45.37,43.34 45.37,49.85 45.37,61.28 45.9,64.77
  pour Bottom: 51.4,45.88 51.4,43.97 39.34,43.97 39.34,45.88 13.94,45.88 8.22,40.16 8.22,9.05 14.57,2.7 41.24,2.7 41.24,7.78 16.48,7.78 13.3,10.95 13.3,38.26 16.48,41.43 73.63,41.43 76.8,38.26 76.8,10.95 73.63,7.78 48.86,7.78 48.86,2.7 75.53,2.7 81.88,9.05 81.88,40.16 76.17,45.88
  pour Top: 51.4,45.88 51.4,43.97 39.34,43.97 39.34,45.88 13.94,45.88 8.22,40.16 8.22,9.05 14.57,2.7 41.24,2.7 41.24,7.78 16.48,7.78 13.3,10.95 13.3,38.26 16.48,41.43 73.63,41.43 76.8,38.26 76.8,10.95 73.63,7.78 48.86,7.78 48.86,2.7 75.53,2.7 81.88,9.05 81.88,40.16 76.17,45.88
  pour Route2: 6,47.31 86.01,47.31 86.01,100.01 6,100.01
MISO  (2 unrouted)
MISO_3V3  (5 unrouted)
MOSI  (1 unrouted)
MOSI_3V3  (4 unrouted)
N$1  (1 unrouted)
N$2  (2 unrouted)
N$15  (1 unrouted)
N$16  (1 unrouted)
N$17  (1 unrouted)
N$18  (1 unrouted)
N$19  (1 unrouted)
N$20
  Bottom 0.406: R28.2 41.24,63.92 C42.1
N$21  (2 unrouted)
N$22  (1 unrouted)
N$23  (1 unrouted)
N$24
  Bottom 0.406: C36.2 C37.2 42.62,57.78 C33.2 | TP11.TP C33.2 | C33.2 42.62,60.59 L5.2 43.68,63.03 R28.1
N$25
  Bottom 0.406: C34.1 C35.1 48.12,57.78 C32.1 | TP10.TP C32.1 | L6.2 48.12,60.59 C32.1
N$26  (2 unrouted)
N$27
  Bottom 0.406: R26.1 48.86,51.65 C39.1 C38.1 48.23,54.29 C35.2 C34.2
N$28  (1 unrouted)
N$29  (2 unrouted)
N$30  (2 unrouted)
N$31  (1 unrouted)
N$32  (1 unrouted)
N$33  (1 unrouted)
N$43
  Bottom 0.406: R27.1 41.88,51.65 C41.2 C40.2 42.51,54.29 C37.1 C36.1
RX  (2 unrouted)
SCK  (1 unrouted)
SCK_3V3  (4 unrouted)
SCL  (2 unrouted)
SCL_3V3  (1 unrouted)
SDA  (2 unrouted)
SDA_3V3  (1 unrouted)
TFT_BL  (1 unrouted)
TFT_DC  (1 unrouted)
TFT_DC_3V3  (1 unrouted)
TOUCH_IRQ  (2 unrouted)
TOUCH_IRQ_3V3  (2 unrouted)
TOUCH_SS_3V3  (1 unrouted)
XL  (1 unrouted)
XR  (1 unrouted)
YD  (1 unrouted)
YU  (1 unrouted)